# Altium project BLE_tag_hv2.PrjPcb
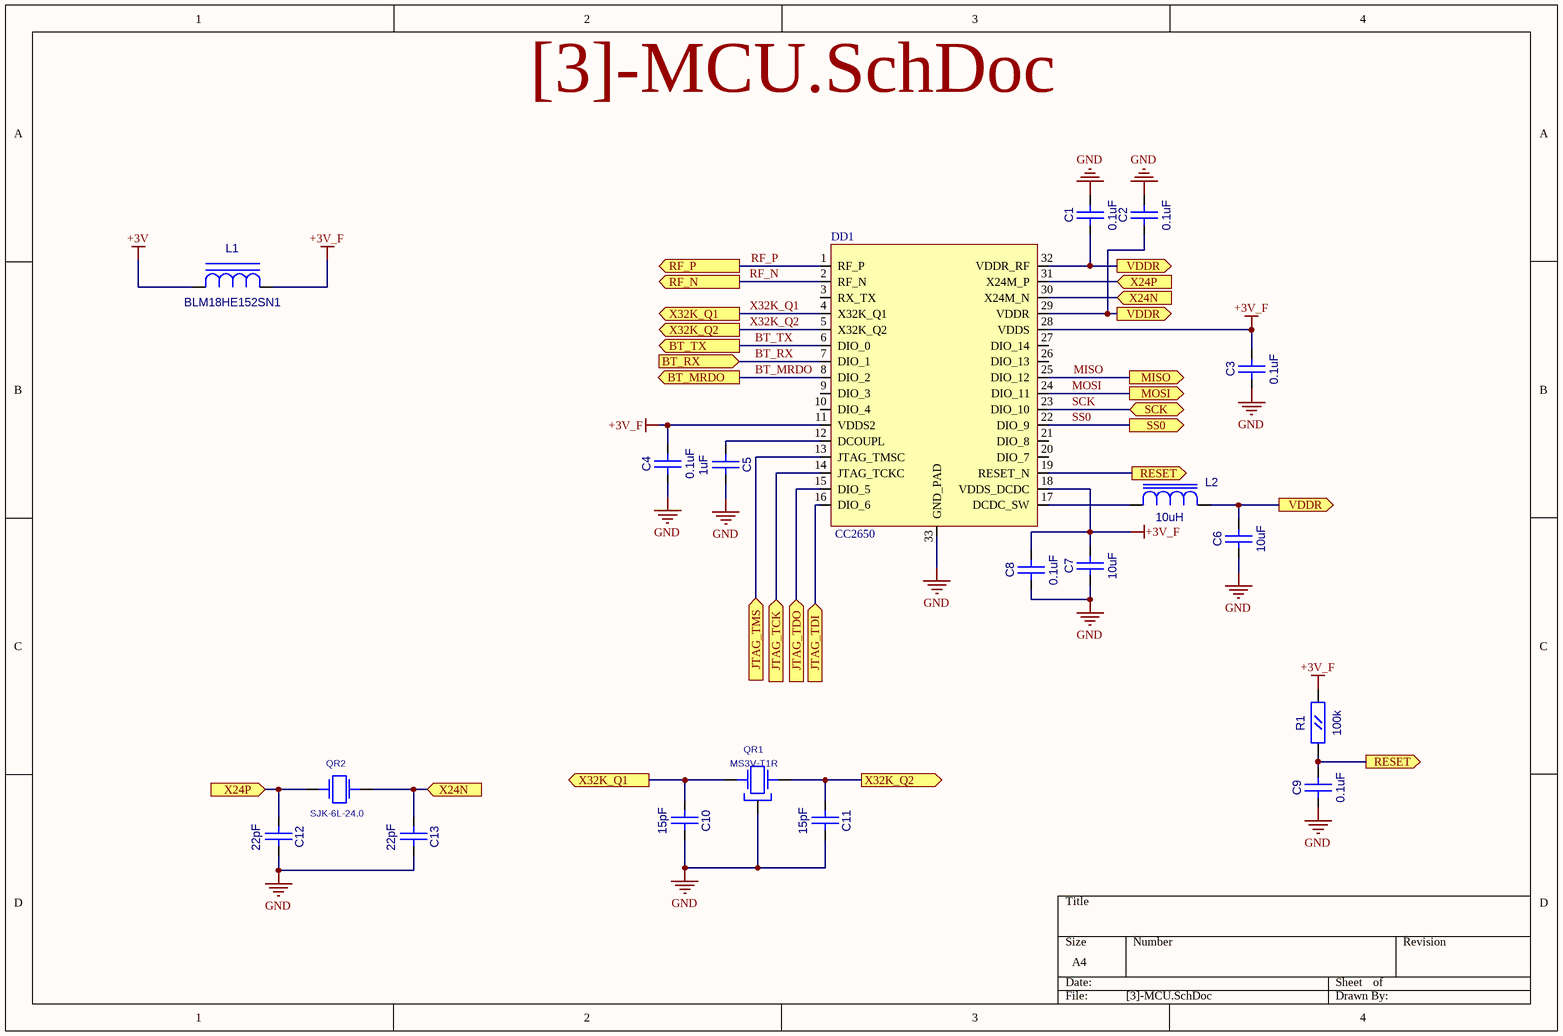
[diagram p0: [3]-MCU.SchDoc]
3 sheets, 33 parts. Net scope: flat (ports and power ports of the same name join across sheets).
Board file: BLE_tag_hv2.PcbDoc
Sheets:
  [3]-MCU.SchDoc
  [4]-RF.SchDoc
  [5]-CONNECTORS.SchDoc

## Sheet [3]-MCU.SchDoc
size A4

### Parts
C1  0.1uF  [CC0603]
C2  0.1uF  [CC0603]
C3  0.1uF  [CC0603]
C4  0.1uF  [CC0603]
C5  1uF  [CC0603]
C6  10uF  [CC0805]
C7  10uF  [CC0805]
C8  0.1uF  [CC0603]
C9  0.1uF  [CC0603]
C10  15pF  [CC0603]
C11  15pF  [CC0603]
C12  22pF  [CC0603]
C13  22pF  [CC0603]
DD1  CC2650  [QFN32_TI]
L1  BLM18HE152SN1  [L0603]
L2  10uH  [RC0805]
QR1  MS3V-T1R  [MS3V-T1R]
QR2  SJK-6L-24.0  [AC5032_2]
R1  100k  [RC0603]

### Ports
BT_MRDO (out), BT_RX (in), BT_TX (out), JTAG_TCK (in), JTAG_TDI (in), JTAG_TDO (in), JTAG_TMS (in), MISO (out), MOSI (out), RESET (out), RF_N (out), RF_P (out), SCK (bidir), SS0 (out), VDDR (out), X24N (in), X24P (in), X32K_Q1 (out), X32K_Q2 (out)

### Nets
+3V: L1.1(A)
+3V_F: C3.2(B) C4.2(B) C7.2(B) C8.2(B) DD1.11(VDDS2) DD1.18(VDDS_DCDC) DD1.28(VDDS) L1.2(C) R1.2(B)
GND: C1.2(B) C2.2(B) C3.1(A) C4.1(A) C5.2(B) C6.1(A) C7.1(A) C8.1(A) C9.1(A) C10.2(B) C11.2(B) C12.2(B) C13.2(B) DD1.33(GND_PAD) QR1.3
BT_MRDO: DD1.8(DIO_2) ; port BT_MRDO
BT_RX: DD1.7(DIO_1) ; port BT_RX
BT_TX: DD1.6(DIO_0) ; port BT_TX
JTAG_TCK: DD1.14(JTAG_TCKC) ; port JTAG_TCK
JTAG_TDI: DD1.16(DIO_6) ; port JTAG_TDI
JTAG_TDO: DD1.15(DIO_5) ; port JTAG_TDO
JTAG_TMS: DD1.13(JTAG_TMSC) ; port JTAG_TMS
MISO: DD1.25(DIO_12) ; port MISO
MOSI: DD1.24(DIO_11) ; port MOSI
RESET: C9.2(B) DD1.19(RESET_N) R1.1(A) ; port RESET
RF_N: DD1.2(RF_N) ; port RF_N
RF_P: DD1.1(RF_P) ; port RF_P
SCK: DD1.23(DIO_10) ; port SCK
SS0: DD1.22(DIO_9) ; port SS0
X32K_Q1: C10.1(A) DD1.4(X32K_Q1) QR1.2(X2) ; port X32K_Q1
X32K_Q2: C11.1(A) DD1.5(X32K_Q2) QR1.1(X1) ; port X32K_Q2
NetC1_1: C1.1(A) C2.1(A) C6.2(B) DD1.29(VDDR) DD1.32(VDDR_RF) L2.2(B) ; port VDDR
NetC5_1: C5.1(A) DD1.12(DCOUPL)
NetC12_1: C12.1(A) DD1.31(X24M_P) QR2.1 ; port X24P
NetC13_1: C13.1(A) DD1.30(X24M_N) QR2.2 ; port X24N
NetDD1_17: DD1.17(DCDC_SW) L2.1(A)

Not connected (* = marked no-connect by the designer): DD1 3(RX_TX) 9(DIO_3) 10(DIO_4) 20(DIO_7) 21(DIO_8) 26(DIO_13) 27(DIO_14)

### Library data of the parts
C1-C5 C8-C13 = CC0603
  C1-C4 C8 C9: Value: 0.1uF
  C5: Value: 1uF
  C10 C11: Value: 15pF
  C12 C13: Value: 22pF
C6 C7 = CC0805: Value: 10uF
DD1 = CC2650RHB: CC2650RHBT; Value: CC2650
L1 = L0603: Value: BLM18HE152SN1
L2 = L0805: Value: 10uH
QR1 = MS3V-T1R: CRYSTAL_32768 Hz; Value: *
QR2 = AC5032_2: AC5032/2; Value: SJK-6L-24.0
R1 = RC0603: Value: 100k

## Sheet [4]-RF.SchDoc
size A4
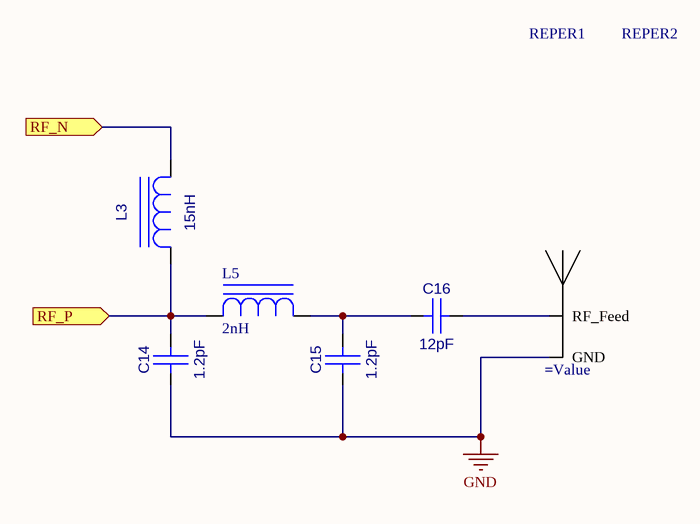
[diagram p1: [4]-RF.SchDoc]

### Parts
=Value  ANTENNA_IFA_245_1MM  [IFA245_1mm]  (value not drawn)
C14  1.2pF  [CC0603]
C15  1.2pF  [CC0603]
C16  12pF  [CC0603]
L3  value 15nH  [L0603]  (hidden comment: L0603)
L5  2nH  [L0402]
REPER1  REPER1.2  [REPER1.2]  (value not drawn)
REPER2  REPER1.2  [REPER1.2]  (value not drawn)

### Ports
RF_N (in), RF_P (in)

### Nets
GND: =Value.2(GND) C14.1(A) C15.1(A)
RF_N: L3.2(C) ; port RF_N
RF_P: C14.2(B) L3.1(A) L5.1(A) ; port RF_P
Net=Value_1: =Value.1(RF_Feed) C16.2(B)
NetC15_2: C15.2(B) C16.1(A) L5.2(C)

Not connected (* = marked no-connect by the designer): REPER1 1; REPER2 1

### Library data of the parts
=Value = ANTENNA_IFA_245_1MM: Antenna 2.45GHz; Value: IFA 2.45GHz
C14-C16 = CC0603
  C14 C15: Value: 1.2pF
  C16: Value: 12pF
L5 = L0402: Value: 2nH
REPER1 REPER2 = REPER1.2: Value: *

## Sheet [5]-CONNECTORS.SchDoc
size A4
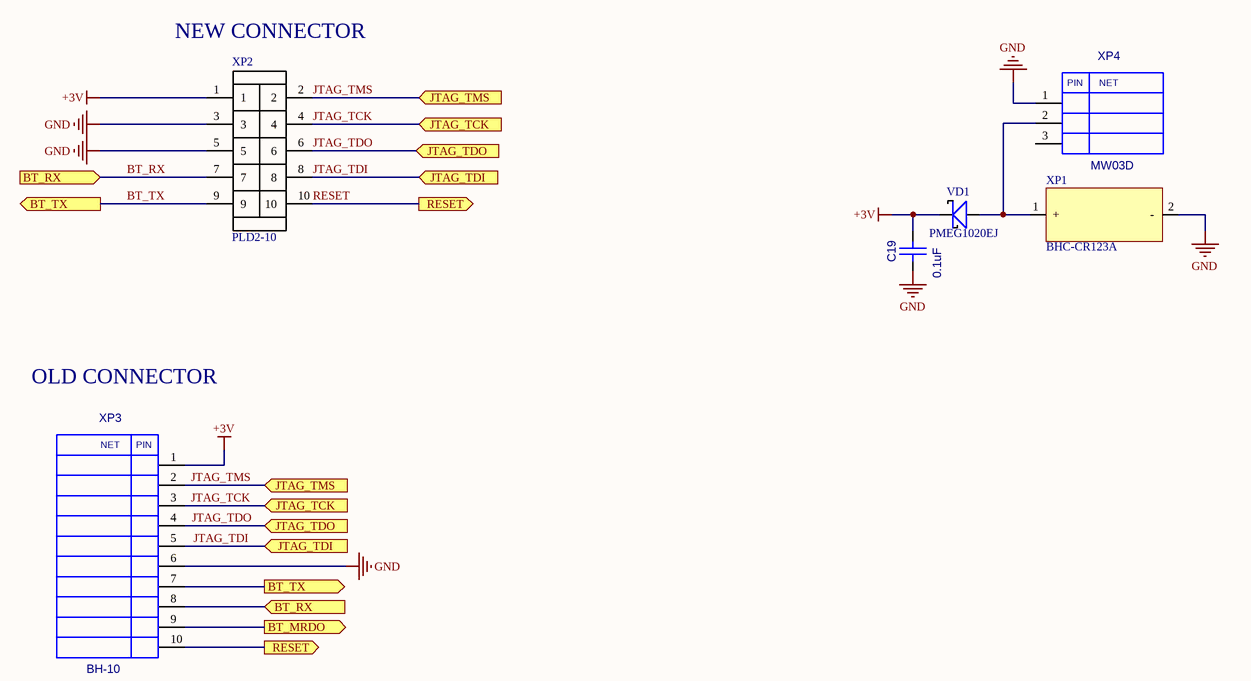
[diagram p2: [5]-CONNECTORS.SchDoc]

### Parts
C19  0.1uF  [CC0603]
VD1  PMEG1020EJ  [SOD323]
XP1  BHC-CR123A  [CR123_HOLDER]
XP2  PLD2-10  [PLD2-10]
XP3  BH-10  [BH-10]
XP4  MW03D  [MW03D]

### Ports
BT_MRDO (out), BT_RX (in), BT_TX (out), JTAG_TCK (in), JTAG_TDI (in), JTAG_TDO (in), JTAG_TMS (in), RESET (out)

### Nets
+3V: C19.2(B) VD1.2(K) XP2.1 XP3.1
GND: C19.1(A) XP1.2(-) XP2.3 XP2.5 XP3.6 XP4.1
BT_MRDO: XP3.9 ; port BT_MRDO
BT_RX: XP2.7 XP3.8 ; port BT_RX
BT_TX: XP2.9 XP3.7 ; port BT_TX
JTAG_TCK: XP2.4 XP3.3 ; port JTAG_TCK
JTAG_TDI: XP2.8 XP3.5 ; port JTAG_TDI
JTAG_TDO: XP2.6 XP3.4 ; port JTAG_TDO
JTAG_TMS: XP2.2 XP3.2 ; port JTAG_TMS
RESET: XP2.10 XP3.10 ; port RESET
NetVD1_1: VD1.1(A) XP1.1(+) XP4.2

Not connected (* = marked no-connect by the designer): XP4 3

### Notes on the sheet
- (near XP2) NEW CONNECTOR
- OLD CONNECTOR
- (in symbol BH-10) NET; PIN
- (in symbol MW03D) PIN; NET

### Library data of the parts
C19 = CC0603: Value: 0.1uF
VD1 = PMEG2010: Value: PMEG1020EJ
XP1 = BHC-CR123A: Holder for CR123 battery; Value: BHC-CR123A
XP2 = PLD2-10: Value: PLD2-10
XP3 = BH-10: Value: *
XP4 = MW03D: Value: *

## Nets that join several sheets
+3V: [3]-MCU (L1.1), [5]-CONNECTORS (C19.2 VD1.2 XP2.1 XP3.1)
GND: [3]-MCU (15 pins), [4]-RF (=Value.2 C14.1 C15.1), [5]-CONNECTORS (6 pins)
BT_MRDO: [3]-MCU (DD1.8), [5]-CONNECTORS (XP3.9)
BT_RX: [3]-MCU (DD1.7), [5]-CONNECTORS (XP2.7 XP3.8)
BT_TX: [3]-MCU (DD1.6), [5]-CONNECTORS (XP2.9 XP3.7)
JTAG_TCK: [3]-MCU (DD1.14), [5]-CONNECTORS (XP2.4 XP3.3)
JTAG_TDI: [3]-MCU (DD1.16), [5]-CONNECTORS (XP2.8 XP3.5)
JTAG_TDO: [3]-MCU (DD1.15), [5]-CONNECTORS (XP2.6 XP3.4)
JTAG_TMS: [3]-MCU (DD1.13), [5]-CONNECTORS (XP2.2 XP3.2)
RESET: [3]-MCU (C9.2 DD1.19 R1.1), [5]-CONNECTORS (XP2.10 XP3.10)
RF_N: [3]-MCU (DD1.2), [4]-RF (L3.2)
RF_P: [3]-MCU (DD1.1), [4]-RF (C14.2 L3.1 L5.1)